# Altium schematic sheet Incoming_connectors.SchDoc
size A4
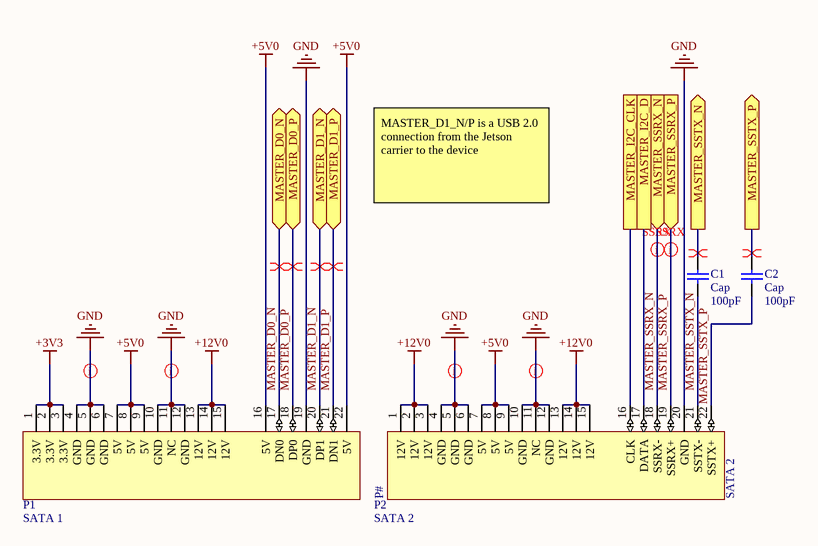
[diagram p0: Incoming_connectors.SchDoc]

## Parts
C1  Cap  value 100pF  [RAD-0.3]
C2  Cap  value 100pF  [RAD-0.3]
P1  SATA 1  [Amphenol 10017660-001LF]
P2  SATA 2  [Amphenol 10017660-001LF]

## Ports
MASTER_D0_N (bidir), MASTER_D0_P (bidir), MASTER_D1_N (bidir), MASTER_D1_P (bidir), MASTER_I2C_CLK, MASTER_I2C_D, MASTER_SSRX_N (in), MASTER_SSRX_P (in), MASTER_SSTX_N (out), MASTER_SSTX_P (out)

## Nets
+3V3: P1.1(3.3V) P1.2(3.3V) P1.3(3.3V)
+5V0: P1.7(5V) P1.8(5V) P1.9(5V) P1.16(5V) P1.22(5V) P2.7(5V) P2.8(5V) P2.9(5V)
+12V0: P1.13(12V) P1.14(12V) P1.15(12V) P2.1(12V) P2.2(12V) P2.3(12V) P2.13(12V) P2.14(12V) P2.15(12V)
GND: P1.4(GND) P1.5(GND) P1.6(GND) P1.10(GND) P1.11(NC) P1.12(GND) P1.19(GND) P2.4(GND) P2.5(GND) P2.6(GND) P2.10(GND) P2.11(NC) P2.12(GND) P2.20(GND)
MASTER_D0_N: P1.17(DN0) ; port MASTER_D0_N
MASTER_D0_P: P1.18(DP0) ; port MASTER_D0_P
MASTER_D1_N: P1.20(DP1) ; port MASTER_D1_N
MASTER_D1_P: P1.21(DN1) ; port MASTER_D1_P
MASTER_I2C_CLK: P2.16(CLK) ; port MASTER_I2C_CLK
MASTER_I2C_D: P2.17(DATA) ; port MASTER_I2C_D
MASTER_SSRX_N: P2.18(SSRX-) ; port MASTER_SSRX_N
MASTER_SSRX_P: P2.19(SSRX+) ; port MASTER_SSRX_P
MASTER_SSTX_N: C1.1 P2.21(SSTX-)
MASTER_SSTX_N: C1.2 ; port MASTER_SSTX_N  [a separate net that carries the same name]
MASTER_SSTX_P: C2.1 P2.22(SSTX+)
MASTER_SSTX_P: C2.2 ; port MASTER_SSTX_P  [a separate net that carries the same name]

## Layout directives
rule Width Constraint [Pref Width = 75mil    Min Width = 50mil    Max Width = 1000mil]: GND
differential pair; rule Signal Stimulus [Kind - Single Pulse    Level - High    Start Time = 0.000    Stop Time = 200.0p    Period Time = 400.0p]: (no net found under the mark), MASTER_SSRX_N, MASTER_SSRX_P
differential pair; rule Signal Stimulus [Kind - Single Pulse    Level - High    Start Time = 0.000    Stop Time = 2.083n    Period Time = 4.167n]: MASTER_D0_N, MASTER_D0_P, MASTER_D1_N, MASTER_D1_P

## Notes on the sheet
- MASTER_D1_N/P is a USB 2.0  connection from the Jetson carrier to the device
- (in symbol SATA 2) P#

## Library data of the parts
C1 C2 = Cap: Capacitor; Published: 8-Jun-2000; LatestRevisionDate: 17-Jul-2002; LatestRevisionNote: Re-released for DXP Platform.; PackageReference: RAD-0.3; Publisher: Altium Limited; PackageDescription: Radial Cap, Thru-Hole; 2 Leads; 0.3 in Pin Spacing
P1 = SATA 1: SATA connector. / Connector 1 for option 1 as per Spec; Supplier 1: Digi-Key
P2 = SATA 2: SATA connector. / Connector 2 for option 1 as per Spec; Supplier 1: Digi-Key